# Altium schematic sheet nk.SchDoc
size A
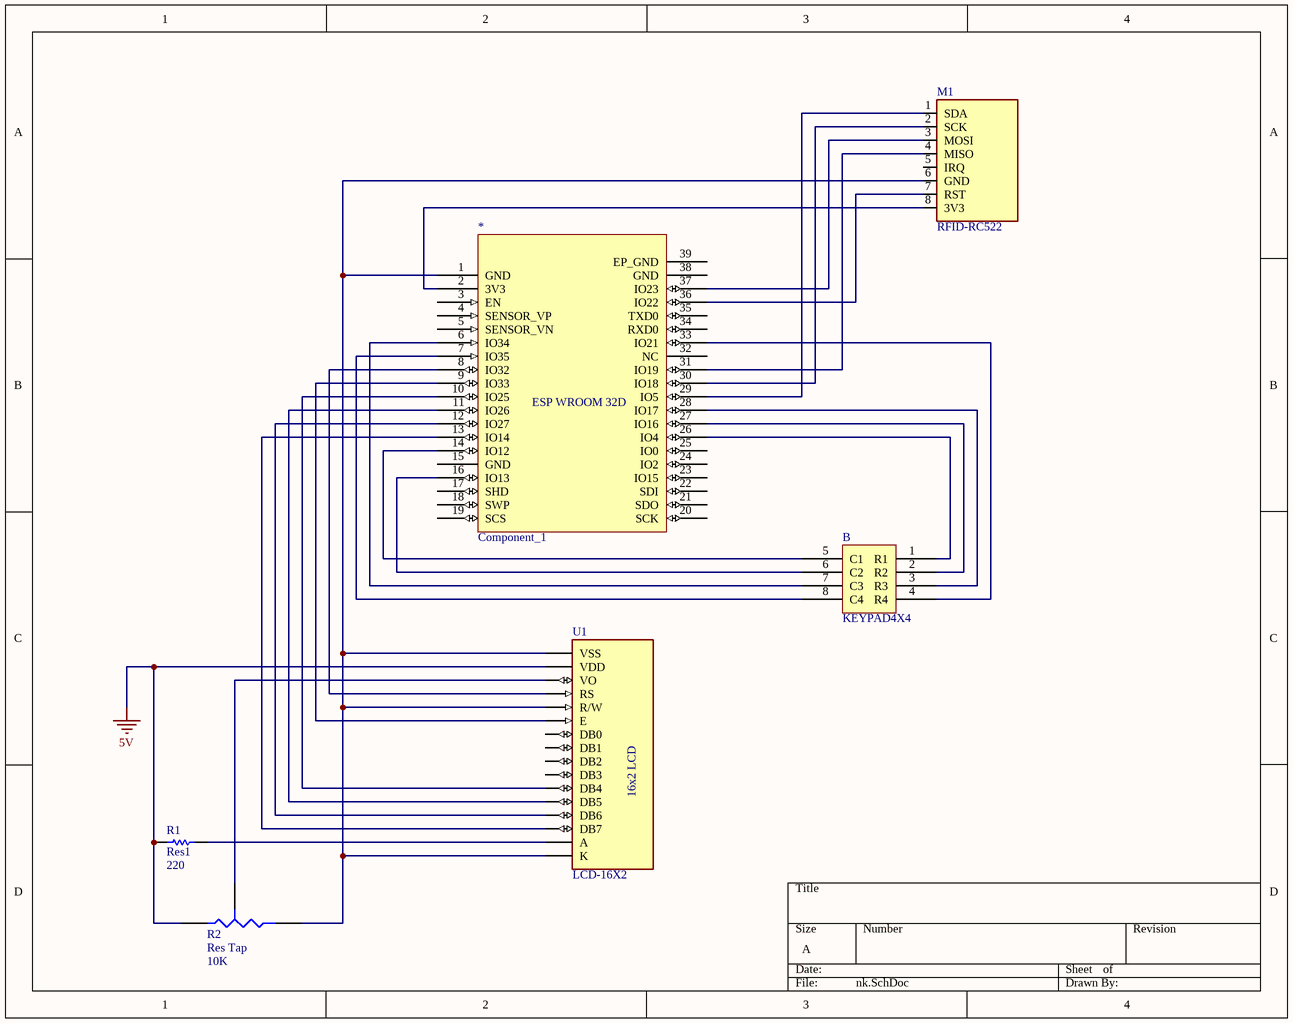
[diagram p0: nk.SchDoc]

## Parts
*  Component_1  [ESP32-WROOM-32D]
?  KEYPAD4X4  (part B of 2)
M1  RFID-RC522  [RFID-RC522]
R1  Res1  value 220  [AXIAL-0.3]
R2  Res Tap  value 10K  [VR3]
U1  LCD-16X2  [MODULE_LCD-16X2]

## Nets
5V: R1.1 R2.1(A) U1.2(VDD)
Net*_1: *.1(GND) M1.6(GND) R2.2(B) U1.1(VSS) U1.5(R/W) U1.16(K)
Net*_2: *.2(3V3) M1.8(3V3)
Net*_6: *.6(IO34) ?.7(C3)
Net*_7: *.7(IO35) ?.8(C4)
Net*_8: *.8(IO32) U1.4(RS)
Net*_9: *.9(IO33) U1.6(E)
Net*_10: *.10(IO25) U1.11(DB4)
Net*_11: *.11(IO26) U1.12(DB5)
Net*_12: *.12(IO27) U1.13(DB6)
Net*_13: *.13(IO14) U1.14(DB7)
Net*_14: *.14(IO12) ?.5(C1)
Net*_16: *.16(IO13) ?.6(C2)
Net*_26: *.26(IO4) ?.1(R1)
Net*_27: *.27(IO16) ?.2(R2)
Net*_28: *.28(IO17) ?.3(R3)
Net*_29: *.29(IO5) M1.1(SDA)
Net*_30: *.30(IO18) M1.2(SCK)
Net*_31: *.31(IO19) M1.4(MISO)
Net*_33: *.33(IO21) ?.4(R4)
Net*_36: *.36(IO22) M1.7(RST)
Net*_37: *.37(IO23) M1.3(MOSI)
NetR1_2: R1.2 U1.15(A)
NetR2_3: R2.3(TAP) U1.3(VO)

Not connected (* = marked no-connect by the designer): * 3(EN) 4(SENSOR_VP) 5(SENSOR_VN) 15(GND) 17(SHD) 18(SWP) 19(SCS) 20(SCK) 21(SDO) 22(SDI) 23(IO15) 24(IO2) 25(IO0) 32(NC) 34(RXD0) 35(TXD0) 38(GND) 39(EP_GND); M1 5(IRQ); U1 7(DB0) 8(DB1) 9(DB2) 10(DB3)

## Notes on the sheet
- (in symbol Component_1) ESP WROOM 32D
- (in symbol LCD-16X2) 16x2 LCD

## Library data of the parts
? = Component_1
M1 = RFID-RC522: Development kit in an integrated reader/writer IC MFRC522 for contactless communication at 13.56 MHz.; MF: Handson Technology; SnapEDA_Link: https://www.snapeda.com/parts/RFID-RC522/Handson+Technology/view-part/?ref=snap; Package: Package; Value: *; MP: RFID-RC522; Check_prices: https://www.snapeda.com/parts/RFID-RC522/Handson+Technology/view-part/?ref=eda
R1 = Res1: Resistor; Published: 8-Jun-2000; LatestRevisionDate: 17-Jul-2002; LatestRevisionNote: Re-released for DXP Platform.; PackageReference: AXIAL-0.3; Publisher: Altium Limited; PackageDescription: Axial Device, Thru-Hole; 2 Leads; 0.3 in Pin Spacing
R2 = Res Tap: Tapped Resistor; Sim Note: Enter the Resistance value and the set point into parameter fields.; Set Position: 0.5; Published: 24-Mar-1999; LatestRevisionDate: 17-Jul-2002; LatestRevisionNote: Re-released for DXP Platform.; PackageReference: VR3; Publisher: Altium Limited; PackageDescription: Variable Resistor, Thru-Hole; 3 Leads
U1 = LCD-16X2: Display Development Tools 16x2 Black on Green Char LCD w Backlight; MF: Gravitech; SnapEDA_Link: https://www.snapeda.com/parts/LCD-16X2/Gravitech/view-part/?ref=snap; Package: None; Value: *; MP: LCD-16X2; Check_prices: https://www.snapeda.com/parts/LCD-16X2/Gravitech/view-part/?ref=eda